# EasyEDA schematic SCH_Smart_Parking_IoT_2023-05-22.json
TITLE: Smart_Parking; REV: 1.2; Date: 2023-04-26; Sheet: 1/1; Drawn By: Nabil Bachroin; Company: NTUST
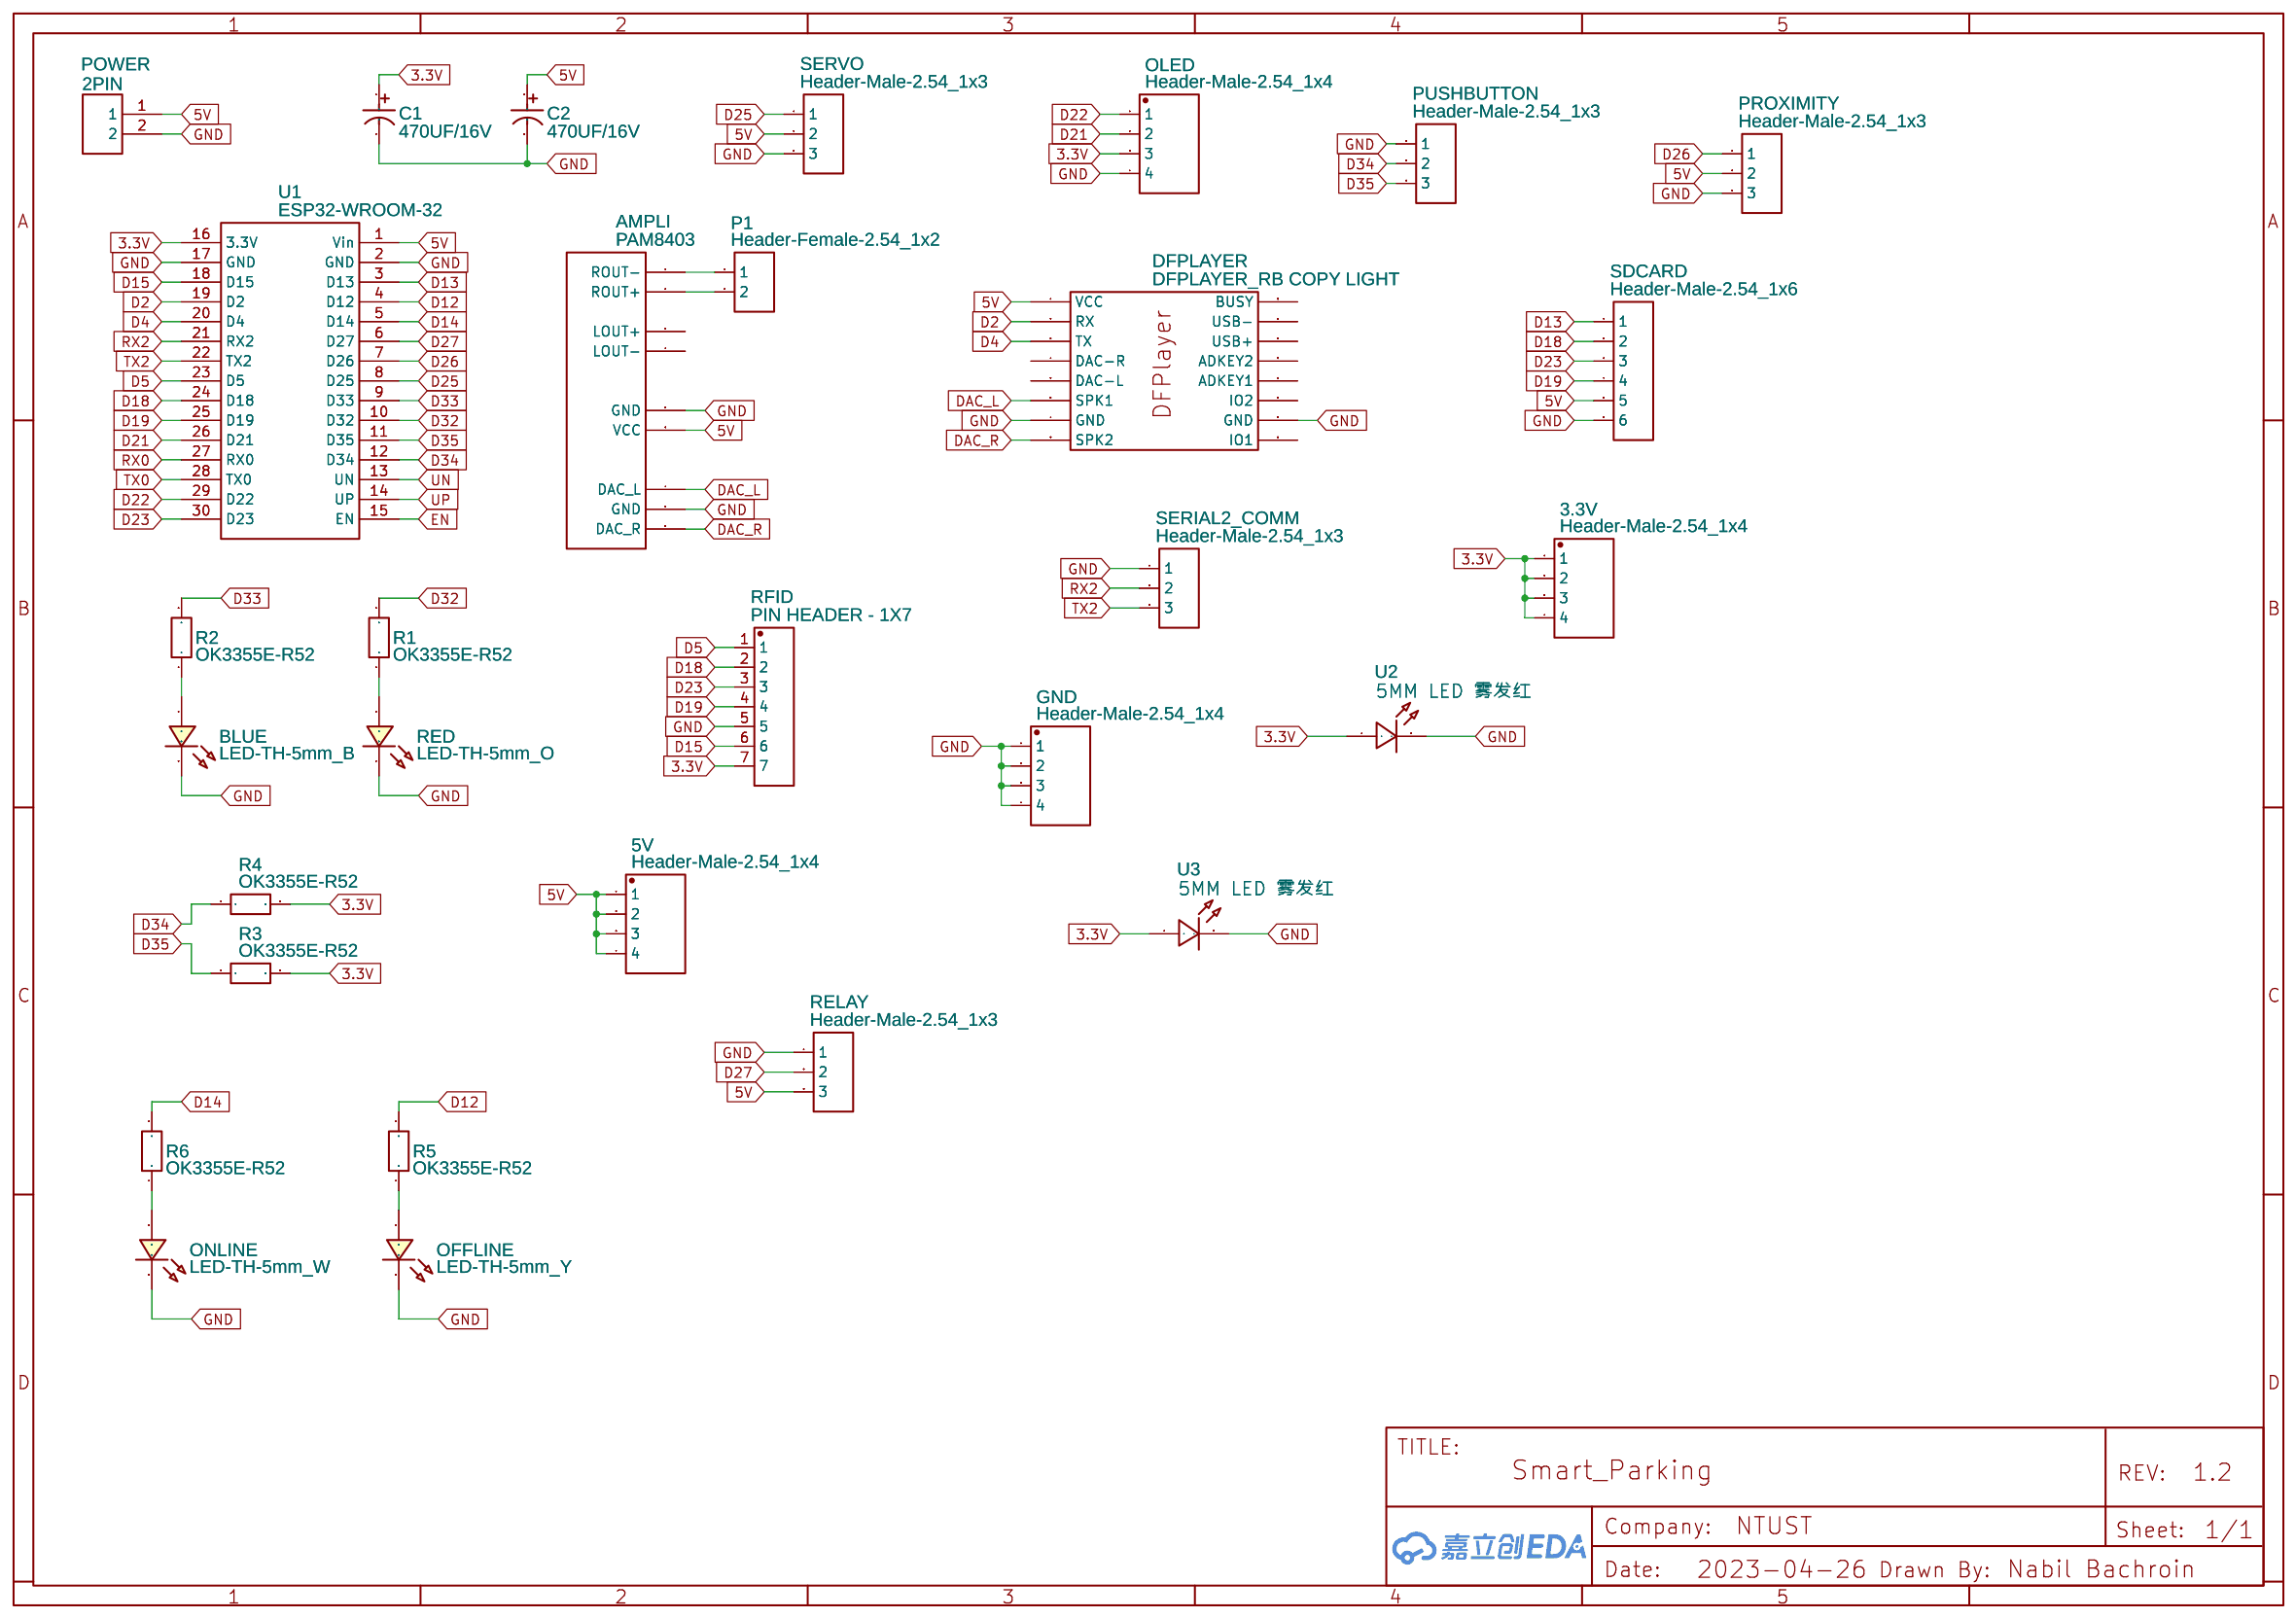
[diagram p0: schematic sheet]

## Parts
3.3V  Header-Male-2.54_1x4  [HDR-TH_4P-P2.54-V-M]
5V  Header-Male-2.54_1x4  [HDR-TH_4P-P2.54-V-M]
AMPLI  PAM8403  [PAM8403]
BLUE  LED-TH-5mm_B  [LED-TH_BD5.0_BLUE]
C1  470UF/16V  [CAP-TH_BD7.8-P3.25-D0.6-FD]
C2  470UF/16V  [CAP-TH_BD7.8-P3.25-D0.6-FD]
DFPLAYER  DFPLAYER_RB COPY LIGHT  [DFPLAYER RB]
GND  Header-Male-2.54_1x4  [HDR-TH_4P-P2.54-V-M]
OFFLINE  LED-TH-5mm_Y  [LED-TH_BD5.0_BLUE]
OLED  Header-Male-2.54_1x4  [HDR-TH_4P-P2.54-V-M]
ONLINE  LED-TH-5mm_W  [LED-TH_BD5.0_BLUE]
P1  Header-Female-2.54_1x2  [HDR-TH_2P-P2.54-V-F]
POWER  2PIN  [PINHEADER1X2]
PROXIMITY  Header-Male-2.54_1x3  [HDR-TH_3P-P2.54-V-M-1]
PUSHBUTTON  Header-Male-2.54_1x3  [HDR-TH_3P-P2.54-V-M-1]
R1  OK3355E-R52  [RES-TH_BD2.5-L6.8-P10.50-D0.5]
R2  OK3355E-R52  [RES-TH_BD2.5-L6.8-P10.50-D0.5]
R3  OK3355E-R52  [RES-TH_BD2.5-L6.8-P10.50-D0.5]
R4  OK3355E-R52  [RES-TH_BD2.5-L6.8-P10.50-D0.5]
R5  OK3355E-R52  [RES-TH_BD2.5-L6.8-P10.50-D0.5]
R6  OK3355E-R52  [RES-TH_BD2.5-L6.8-P10.50-D0.5]
RED  LED-TH-5mm_O  [LED-TH_BD5.0_BLUE]
RELAY  Header-Male-2.54_1x3  [HDR-TH_3P-P2.54-V-M-1]
RFID  PIN HEADER - 1X7  [HEADER - HEADER-FEMALE-2.54_1X7]
SDCARD  Header-Male-2.54_1x6  [HDR-TH_6P-P2.54-V-M-1]
SERIAL2_COMM  Header-Male-2.54_1x3  [HDR-TH_3P-P2.54-V-M-1]
SERVO  Header-Male-2.54_1x3  [HDR-TH_3P-P2.54-V-M-1]
U1  ESP32-WROOM-32  [ESP32-WROOM-32]
U2  5MM LED 雾发红  [LED-TH_BD5.0-P2.54-FD]
U3  5MM LED 雾发红  [LED-TH_BD5.0-P2.54-FD]

## Library data of the parts
3.3V 5V GND OLED = Header-Male-2.54_1x4: Supplier: LCSC; Manufacturer: Ckmtw(灿科盟); Manufacturer Part: B-2100S04P-A110; Contributor: LCSC; Supplier Part: C124378; JLCPCB Part Class: Extended Part
AMPLI = PAM8403: Contributor: esalord
BLUE = LED-TH-5mm_B: Supplier: JDR; Contributor: wrocek_k
C1 C2 = 470UF/16V: Supplier: LCSC; Supplier Part: C9900008131; Manufacturer Part: 470uF/16V; Contributor: LCSC; JLCPCB Part Class: Extended Part; Manufacturer: null
DFPLAYER = DFPLAYER_RB COPY LIGHT: Contributor: rlbrinkman
OFFLINE = LED-TH-5mm_Y: Contributor: MariuszSzczesny
ONLINE = LED-TH-5mm_W: Supplier: LCSC; Contributor: Danny591
P1 = Header-Female-2.54_1x2: Supplier: LCSC; Manufacturer: BOOMELE(博穆精密); Manufacturer Part: 2.54-1*2P母; Supplier Part: C49661; JLCPCB Part Class: Extended Part
POWER = 2PIN: Manufacturer Part: Pin_Header_2; Contributor: jesuecc83
PROXIMITY PUSHBUTTON RELAY SERIAL2_COMM SERVO = Header-Male-2.54_1x3: Supplier: LCSC; Manufacturer: BOOMELE(博穆精密); Manufacturer Part: 2.54-1*3P针; Supplier Part: C49257; JLCPCB Part Class: Extended Part
R1-R6 = OK3355E-R52: Supplier: LCSC; Supplier Part: C3522642; Manufacturer: Ohmite; link: https://atta.szlcsc.comnull; Contributor: lcsc
RED = LED-TH-5mm_O: Supplier: LCSC; Contributor: Рамазан Тулешкалиев
RFID = PIN HEADER - 1X7: Contributor: Harald Bregu
SDCARD = Header-Male-2.54_1x6: Supplier: LCSC; Manufacturer: BOOMELE(博穆精密); Manufacturer Part: 2.54-1x6P直针; Supplier Part: C37208; JLCPCB Part Class: Extended Part
U1 = ESP32-WROOM-32: Manufacturer: Espressif; Supplier: Espressif; link: https://www.espressif.com/sites/default/files/documentation/esp32_datasheet_en.pdf; Contributor: li_necont
U2 U3 = 5MM LED 雾发红: Supplier: LCSC; Supplier Part: C9900034380; Manufacturer: null; Manufacturer Part: 5mm LED 雾发红; link: 2022-11-07/459554A/14e8213d67a04a3dacf5c4dc7c3d6b7a/C2764903.pdf; JLCPCB Part Class: Extended Part; Contributor: lcsc

## Nets
3.3V: 3.3V.1 3.3V.2 3.3V.3 3.3V.4 C1.1 OLED.3 R3.2 R4.2 RFID.7 U1.16(3.3V) U2.1(+) U3.1(+)
5V: 5V.1 5V.2 5V.3 5V.4 AMPLI.6(VCC) C2.1 DFPLAYER.1(VCC) POWER.1 PROXIMITY.2 RELAY.3 SDCARD.5 SERVO.2 U1.1(Vin)
GND: AMPLI.5(GND) AMPLI.8(GND) BLUE.2 C1.2 C2.2 DFPLAYER.7(GND) DFPLAYER.10(GND) GND.1 GND.2 GND.3 GND.4 OFFLINE.2 OLED.4 ONLINE.2 POWER.2 PROXIMITY.3 PUSHBUTTON.1 RED.2 RELAY.1 RFID.5 SDCARD.6 SERIAL2_COMM.1 SERVO.3 U1.2(GND) U1.17(GND) U2.2(-) U3.2(-)
D2: DFPLAYER.2(RX) U1.19(D2)
D4: DFPLAYER.3(TX) U1.20(D4)
D5: RFID.1 U1.23(D5)
D12: R5.2 U1.4(D12)
D13: SDCARD.1 U1.3(D13)
D14: R6.2 U1.5(D14)
D15: RFID.6 U1.18(D15)
D18: RFID.2 SDCARD.2 U1.24(D18)
D19: RFID.4 SDCARD.4 U1.25(D19)
D21: OLED.2 U1.26(D21)
D22: OLED.1 U1.29(D22)
D23: RFID.3 SDCARD.3 U1.30(D23)
D25: SERVO.1 U1.8(D25)
D26: PROXIMITY.1 U1.7(D26)
D27: RELAY.2 U1.6(D27)
D32: R1.2 U1.10(D32)
D33: R2.2 U1.9(D33)
D34: PUSHBUTTON.2 R4.1 U1.12(D34)
D35: PUSHBUTTON.3 R3.1 U1.11(D35)
DAC_L: AMPLI.7(DAC_L) DFPLAYER.6(SPK1)
DAC_R: AMPLI.9(DAC_R) DFPLAYER.8(SPK2)
EN: U1.15(EN)
RX0: U1.27(RX0)
RX2: SERIAL2_COMM.2 U1.21(RX2)
TX0: U1.28(TX0)
TX2: SERIAL2_COMM.3 U1.22(TX2)
UN: U1.13(UN)
UP: U1.14(UP)
Net-(AMPLI-1): AMPLI.1(ROUT-) P1.1
Net-(AMPLI-2): AMPLI.2(ROUT+) P1.2
Net-(BLUE-1): BLUE.1 R2.1
Net-(OFFLINE-1): OFFLINE.1 R5.1
Net-(ONLINE-1): ONLINE.1 R6.1
Net-(R1-1): R1.1 RED.1

Not connected (* = marked no-connect by the designer): AMPLI 3(LOUT+) 4(LOUT-); DFPLAYER 4(DAC-R) 5(DAC-L) 9(IO1) 11(IO2) 12(ADKEY1) 13(ADKEY2) 14(USB+) 15(USB-) 16(BUSY)
